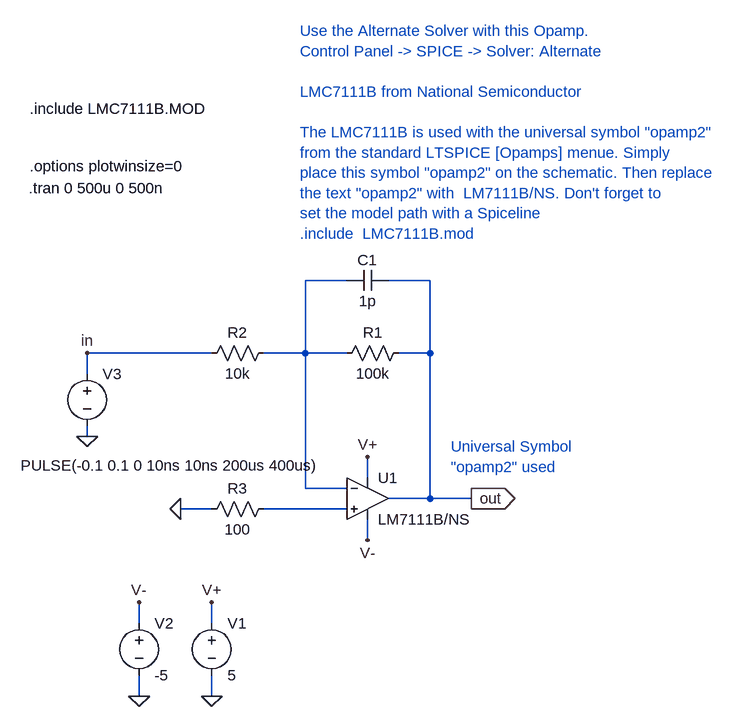
[diagram p0: schematic LMC7111B_test.asc]
LMC7111B_test.asc, the LTspice schematic file:
Version 4
SHEET 1 1200 1172
WIRE -304 16 -304 -16
WIRE -304 112 -304 96
WIRE -224 400 -224 368
WIRE -224 512 -224 480
WIRE -112 -16 -304 -16
WIRE -112 224 -160 224
WIRE -112 400 -112 368
WIRE -112 512 -112 480
WIRE 32 -16 -32 -16
WIRE 32 -16 32 -128
WIRE 32 192 32 -16
WIRE 96 -128 32 -128
WIRE 96 -16 32 -16
WIRE 96 192 32 192
WIRE 96 224 -32 224
WIRE 128 176 128 144
WIRE 128 272 128 240
WIRE 224 -128 160 -128
WIRE 224 -16 176 -16
WIRE 224 -16 224 -128
WIRE 224 208 160 208
WIRE 224 208 224 -16
WIRE 288 208 224 208
FLAG -112 512 0
FLAG -160 224 0
FLAG -304 112 0
FLAG 288 208 out
IOPIN 288 208 Out
FLAG -224 512 0
FLAG -304 -16 in
FLAG 128 144 V+
FLAG 128 272 V-
FLAG -224 368 V-
FLAG -112 368 V+
SYMBOL voltage -112 384 R0
WINDOW 123 0 0 Left 0
WINDOW 39 0 0 Left 0
SYMATTR InstName V1
SYMATTR Value 5
SYMBOL voltage -224 384 R0
WINDOW 123 0 0 Left 0
WINDOW 39 0 0 Left 0
SYMATTR InstName V2
SYMATTR Value -5
SYMBOL res -16 -32 R90
WINDOW 0 0 56 VBottom 0
WINDOW 3 32 56 VTop 0
SYMATTR InstName R2
SYMATTR Value 10k
SYMBOL voltage -304 0 R0
WINDOW 3 -102 157 Left 0
WINDOW 123 0 0 Left 0
WINDOW 39 0 0 Left 0
SYMATTR Value PULSE(-0.1 0.1 0 10ns 10ns 200us 400us)
SYMATTR InstName V3
SYMBOL cap 160 -144 R90
WINDOW 0 0 32 VBottom 0
WINDOW 3 32 32 VTop 0
SYMATTR InstName C1
SYMATTR Value 1p
SYMBOL res 192 -32 R90
WINDOW 0 0 56 VBottom 0
WINDOW 3 32 56 VTop 0
SYMATTR InstName R1
SYMATTR Value 100k
SYMBOL opamp2 128 144 R0
SYMATTR InstName U1
SYMATTR Value LM7111B/NS
SYMBOL res -128 240 R270
WINDOW 0 32 56 VTop 0
WINDOW 3 0 56 VBottom 0
SYMATTR InstName R3
SYMATTR Value 100
TEXT -394 -270 Left 0 !.tran 0 500u 0 500n
TEXT 256 128 Left 0 ;Universal Symbol \n"opamp2" used
TEXT 24 -512 Left 0 ;Use the Alternate Solver with this Opamp.\nControl Panel -> SPICE -> Solver: Alternate\n \nLMC7111B from National Semiconductor\n \nThe LMC7111B is used with the universal symbol "opamp2" \nfrom the standard LTSPICE [Opamps] menue. Simply\nplace this symbol "opamp2" on the schematic. Then replace\nthe text "opamp2" with  LM7111B/NS. Don't forget to \nset the model path with a Spiceline\n.include  LMC7111B.mod
TEXT -392 -304 Left 0 !.options plotwinsize=0
TEXT -392 -392 Left 0 !.include LMC7111B.MOD

The netlist it stands for:
* LMC7111B_test.asc
V1 V+ 0 5
V2 V- 0 -5
R2 N001 in 10k
V3 in 0 PULSE(-0.1 0.1 0 10ns 10ns 200us 400us)
C1 out N001 1p
R1 out N001 100k
XU1 N002 N001 V+ V- out LM7111B/NS  ; pins In+ In- V+ V- OUT
R3 0 N002 100
.tran 0 500u 0 500n
* Universal Symbol
* "opamp2" used
* Use the Alternate Solver with this Opamp.
* Control Panel -> SPICE -> Solver: Alternate
* LMC7111B from National Semiconductor
* The LMC7111B is used with the universal symbol "opamp2"
* from the standard LTSPICE [Opamps] menue. Simply
* place this symbol "opamp2" on the schematic. Then replace
* the text "opamp2" with  LM7111B/NS. Don't forget to
* set the model path with a Spiceline
* .include  LMC7111B.mod
.options plotwinsize=0
.include LMC7111B.MOD
.backanno
.end